# EAGLE schematic external_fan_controller (EAGLE 9.5.1)
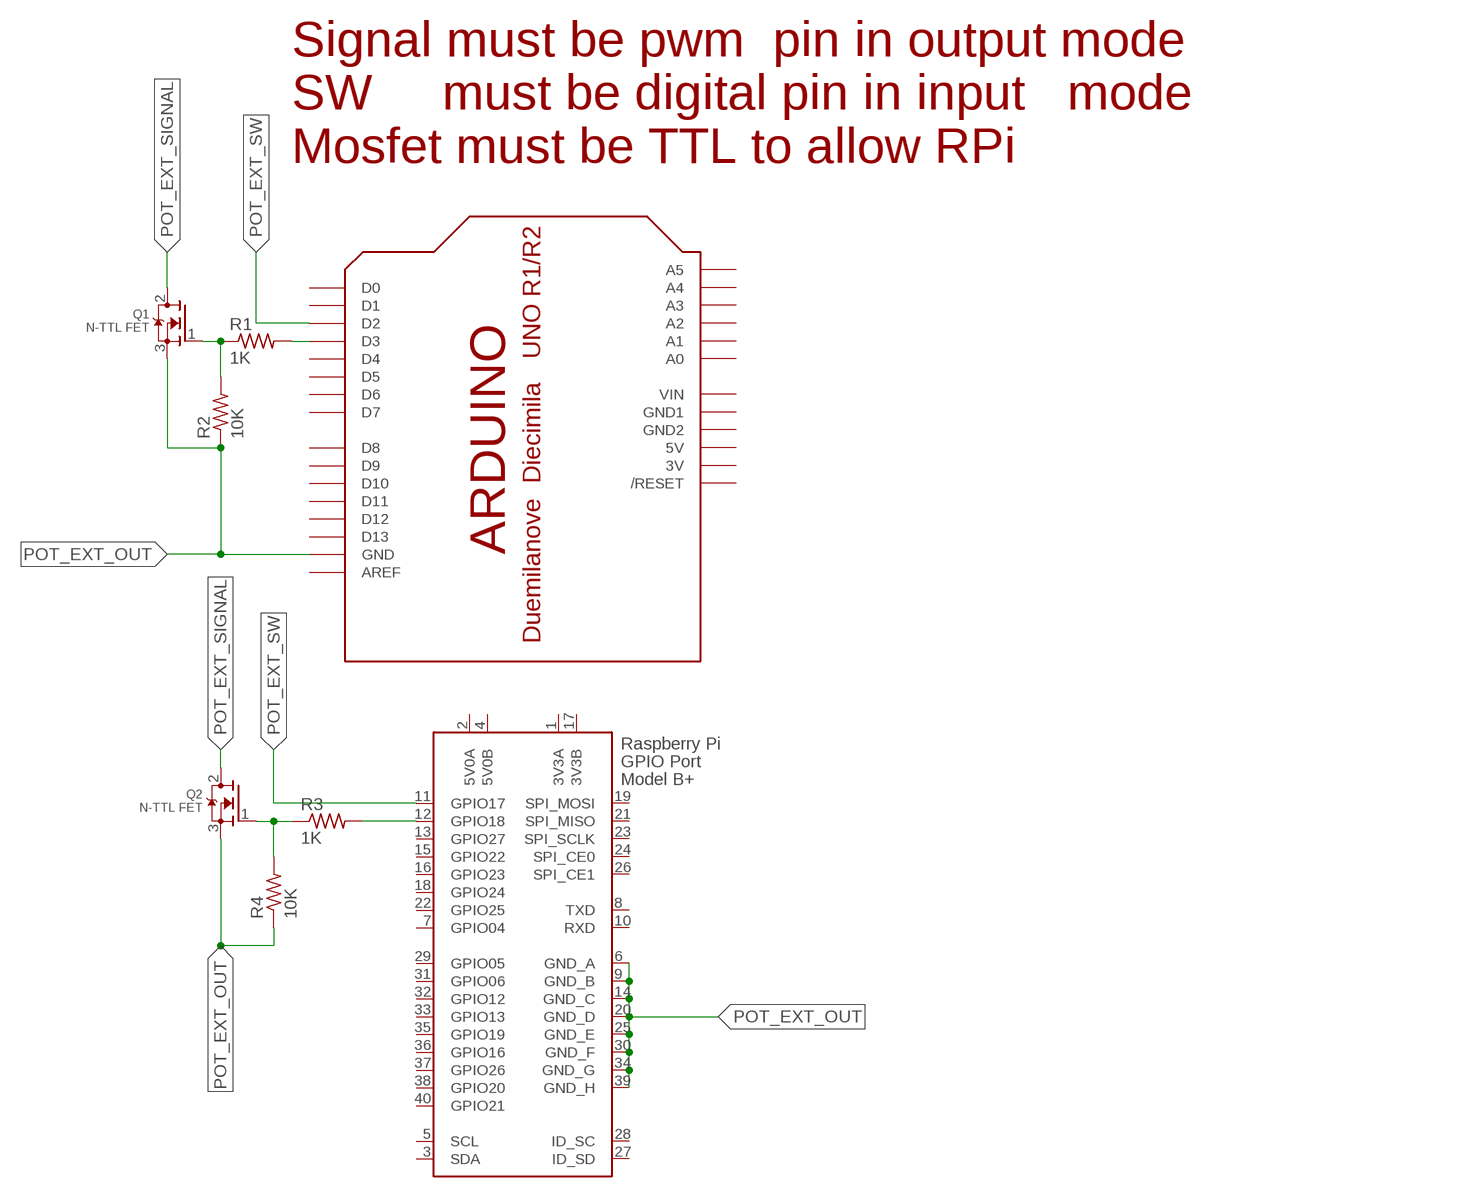
[diagram p0: schematic, sheet 1]

## Parts
Q1  N-TTL FET  MOSFET-NGDS_TO220V  [TO220V]
Q2  N-TTL FET  MOSFET-NGDS_TO220V  [TO220V]
R1  1K  R-US_0204/5  [0204/5]
R2  10K  R-US_0204/5  [0204/5]
R3  1K  R-US_0204/5  [0204/5]
R4  10K  R-US_0204/5  [0204/5]
U$1  ARDUINOUNO  [ARDUINO]
X1  RASPI_BOARD_B+#_HD  [RASPI_BOARD_B+HAT_DF]

## Nets
N$1: Q1.1(G) R1.1 R2.2
N$2: R1.2 U$1.D3
N$3: R3.2 X1.12(GPIO18)
N$4: Q2.1(G) R3.1 R4.2
POT_EXT_OUT: Q1.3(S) Q2.3(S) R2.1 R4.1 U$1.GND X1.6(GND_A) X1.9(GND_B) X1.14(GND_C) X1.20(GND_D) X1.25(GND_E) X1.30(GND_F) X1.34(GND_G) X1.39(GND_H)
POT_EXT_SIGNAL: Q1.2(D) Q2.2(D)
POT_EXT_SW: U$1.D2 X1.11(GPIO17)
Unconnected: U$1.A0 U$1.A1 U$1.A2 U$1.A3 U$1.A4 U$1.A5 U$1.AREF U$1.D0 U$1.D1 U$1.D4 U$1.D5 U$1.D6 U$1.D7 U$1.D8 U$1.D9 U$1.D10 U$1.D11 U$1.D12 U$1.D13 U$1.RESET(/RESET) X1.3(SDA) X1.5(SCL) X1.7(GPIO04) X1.8(TXD) X1.10(RXD) X1.13(GPIO27) X1.15(GPIO22) X1.16(GPIO23) X1.18(GPIO24) X1.19(SPI_MOSI) X1.21(SPI_MISO) X1.22(GPIO25) X1.23(SPI_SCLK) X1.24(SPI_CE0) X1.26(SPI_CE1) X1.27(ID_SD) X1.28(ID_SC) X1.29(GPIO05) X1.31(GPIO06) X1.32(GPIO12) X1.33(GPIO13) X1.35(GPIO19) X1.36(GPIO16) X1.37(GPIO26) X1.38(GPIO20) X1.40(GPIO21)

## Notes on the sheet
- Signal must be pwm  pin in output mode
  SW     must be digital pin in input   mode
  Mosfet must be TTL to allow RPi

## Power pins joined to a net without a drawn wire
3V: U$1.3V
3V3A: X1.1(3V3A)
3V3B: X1.17(3V3B)
5V: U$1.5V
5V0A: X1.2(5V0A)
5V0B: X1.4(5V0B)
GND1: U$1.GND1
GND2: U$1.GND2
VIN: U$1.VIN

## Library data of the parts
Q1 Q2 = adafruit:MOSFET-N: N-Channel Mosfet 2N7002E - 60V 260mA SOT23 [Digikey: 2N7002ET1GOSTR-ND] - REEL BSH103 - 30V 850mA SOT23 [Digikey: 568-5013-1-ND]
R1-R4 = adafruit:R-US_: RESISTOR, American symbol
U$1 = adafruit:ARDUINO: Arduino Diecimila/Duemilanove Make a shield with ease, this package has all the named pins as well as the two mounting drill holes and an outline of the USB and DC power connector. The outline is on the DIMENSION layer, so if your board house uses it they will cut the outline to match. http://www.ladyada.net/library/pcb/eaglelibrary.html
X1 = raspberrypi_bastelstube_v13:RASPI_BOARD_B+#: Raspberry Pi GPIO connector with markings for the outer dimensions of the Raspberry Pi board model B+ with different sets of drill holes or mounting pads All pins connected